# EAGLE design UltrasonicSensor (EAGLE 7.5.0)
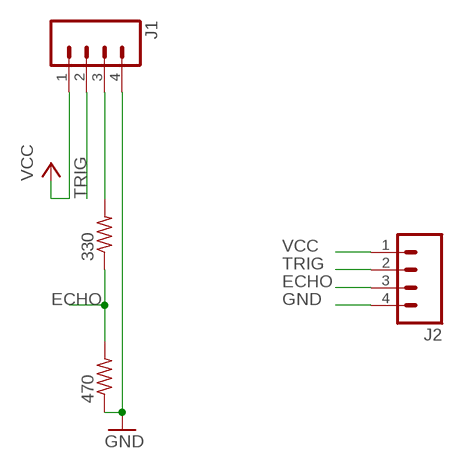
[diagram p0: schematic, sheet 1]

## Parts
330  R-US_0204/5  [0204/5]
470  R-US_0204/5  [0204/5]
J1  M04NO_SILK_ALL_ROUND  [1X04_NO_SILK_ALL_ROUND]
J2  M04NO_SILK_ALL_ROUND  [1X04_NO_SILK_ALL_ROUND]

## Nets
ECHO: 330.1 470.2 J2.3
GND: 470.1 J1.4 J2.4
N$3: 330.2 J1.3
TRIG: J1.2 J2.2
VCC: J1.1 J2.1

## Library data of the parts
330 470 = resistor:R-US_: RESISTOR, American symbol
J1 J2 = SparkFun-Connectors:M04: Header 4 Standard 4-pin 0.1" header. Use with straight break away headers (SKU : PRT-00116), right angle break away headers (PRT-00553), swiss pins (PRT-00743), machine pins (PRT-00117), and female headers (PRT-00115). Molex polarized connector foot print use with SKU : PRT-08231 with associated crimp pins and housings. 1MM SMD Version SKU: PRT-10208; PROD_ID: CONN-09696

## Board
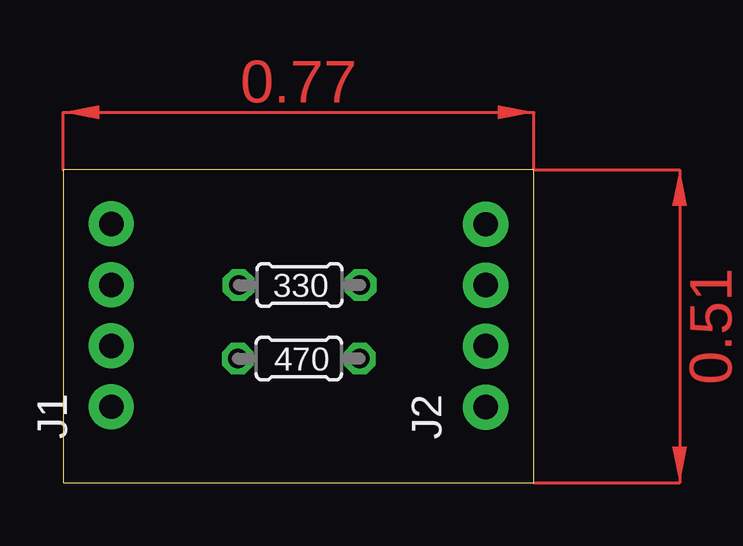
[diagram p1: board, top side]
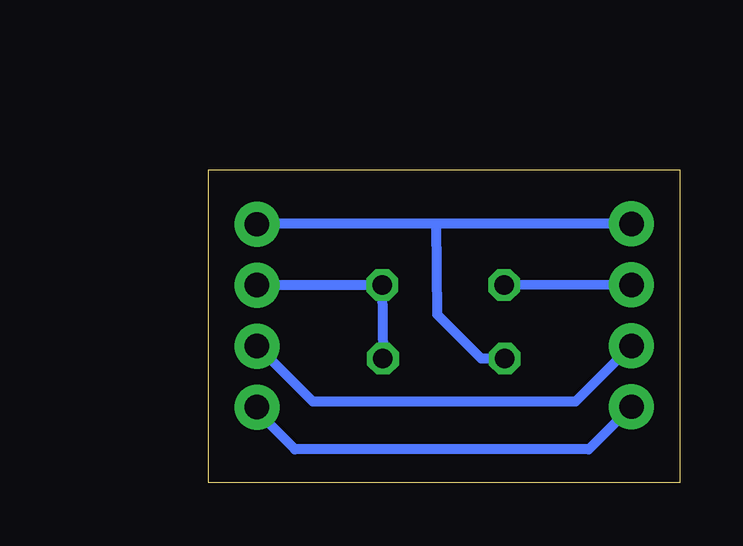
[diagram p2: board, bottom side, seen from below]

Size 19.63 x 13.04 mm. Coordinates in mm from the lower left corner, seen from the top.
Outline: 0,0 19.63,0 19.63,13.04 0,13.04 0,0
Copper layers (1*16): Top 0.035mm / dielectric 1.5mm / Bottom 0.035mm
Design rules "default": minimum track width 10mil, minimum drill 24mil, track to track 8mil, track to pad 8mil, pad to pad 8mil, via to via 8mil, smd to smd 8mil, copper to edge 40mil, drill to drill 8mil, minimum pad ring 10mil, minimum via ring 8mil, stop-mask expansion 4mil, vias tented up to drill 0mil, thermal gap 10mil

### Footprints (pad centres in the part's own frame; a part is rotated, then mirrored left to right if it is on the bottom)
0204/5 = drill 0.813 octagon: 1 -2.54,0; 2 2.54,0
1X04_NO_SILK_ALL_ROUND = drill 1.016 pad 1.88: 1 0,0; 2 2.54,0; 3 5.08,0; 4 7.62,0

### Placement (x,y rotation side)
330  9.86,8.24 180 top
470  9.83,5.17 0 top
J1  2.01,3.17 90 top
J2  17.62,3.15 90 top

### Tracks (layer width: path | path; a pad name or v marks a point on that pad's centre or on a via)
ECHO
  Bottom 0.406: J2.3 330.1 470.2
GND
  Bottom 0.406: J1.4 10.13,10.79 | 10.13,10.79 J2.4 | 470.1 8.26,5.17 10.1,7.01 10.13,10.79
N$3
  Bottom 0.406: J1.3 330.2
TRIG
  Bottom 0.406: J1.2 4.34,3.38 15.29,3.38 17.6,5.69 J2.2
VCC
  Bottom 0.406: J1.1 3.79,1.39 16.03,1.39 17.62,2.97 J2.1
(copper drawn outside any net)
  shapes: Top area x2